# Altium project STM32-ROMI_Rev_A_Reworks.PrjPcb (part 2 of 3)

## Sheet STM32-ROMI_Rev_A_3_OLED_Sensor.SchDoc
size A
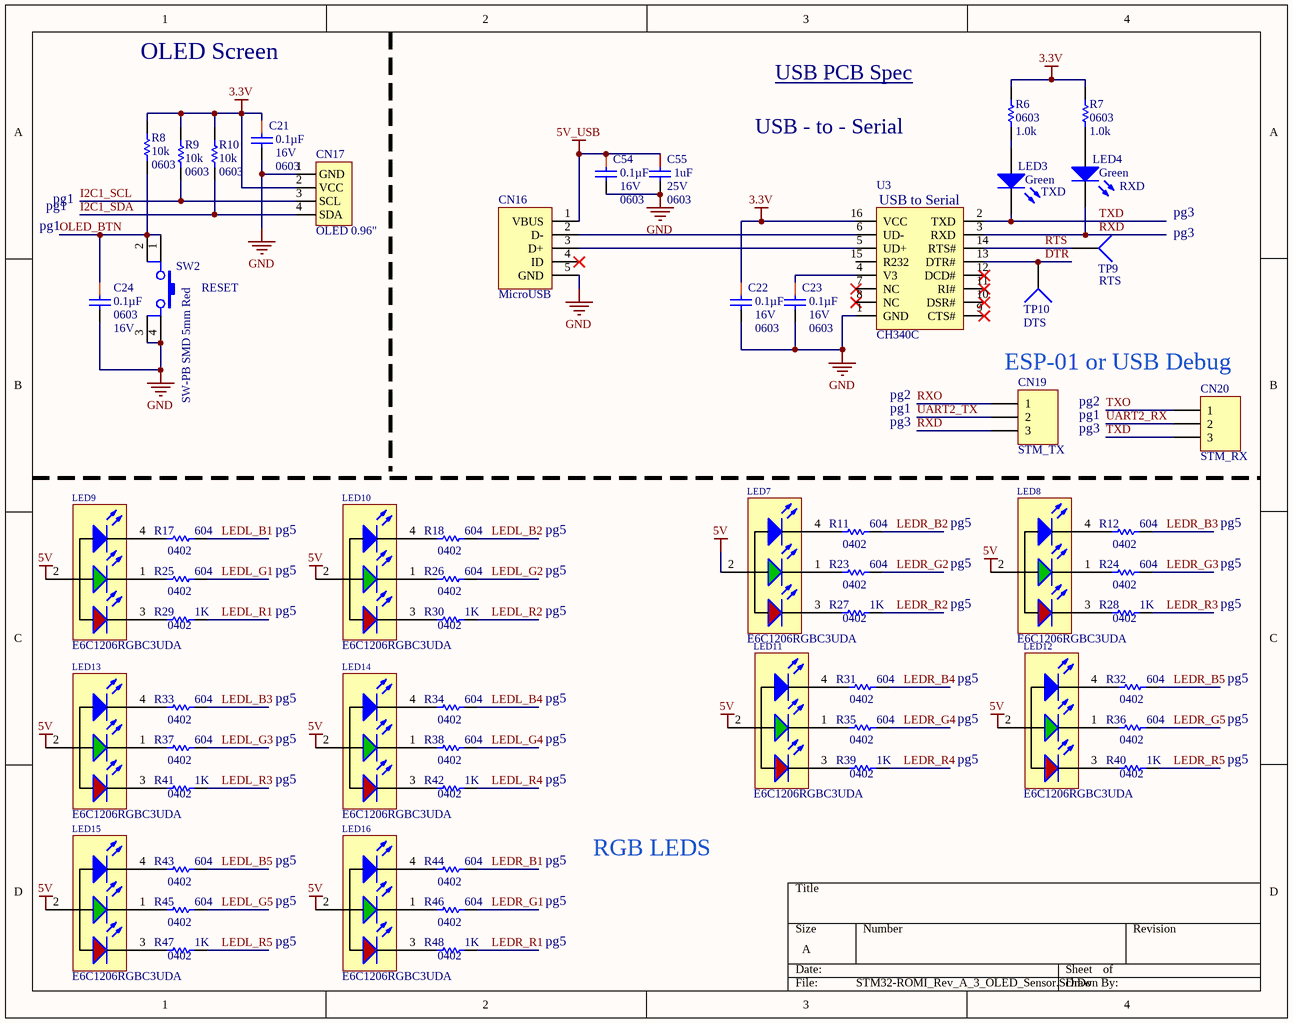
[diagram p3: STM32-ROMI_Rev_A_3_OLED_Sensor.SchDoc]

### Parts
C21  Capacitance: 0.1µF  Package / Case: 0603  Voltage - Rated: 16V  [CAPC0603(1608)_L]  (hidden comment: 0.1uF)
C22  Capacitance: 0.1µF  Package / Case: 0603  Voltage - Rated: 16V  [CAPC0603(1608)_L]  (hidden comment: 0.1uF)
C23  Capacitance: 0.1µF  Package / Case: 0603  Voltage - Rated: 16V  [CAPC0603(1608)_L]  (hidden comment: 0.1uF)
C24  Capacitance: 0.1µF  Package / Case: 0603  Voltage - Rated: 16V  [CAPC0603(1608)_L]  (hidden comment: 0.1uF)
C54  Capacitance: 0.1µF  Package / Case: 0603  Voltage - Rated: 16V  [CAPC0603(1608)_L]  (hidden comment: 0.1uF)
C55  1uF  Voltage - Rated: 25V  Package / Case: 0603  [CAPC0603(1608)_N]
CN16  MicroUSB  [10118194-0001LF]
CN17  OLED 0.96"  [OLED_0.96_I2C]
CN19  STM_TX  [HDR1X3]
CN20  STM_RX  [HDR1X3]
LED3  TXD  Color: Green  [SM-LED-0603]
LED4  RXD  Color: Green  [SM-LED-0603]
LED7  E6C1206RGBC3UDA  [E6C1206RGBC3UDA]
LED8  E6C1206RGBC3UDA  [E6C1206RGBC3UDA]
LED9  E6C1206RGBC3UDA  [E6C1206RGBC3UDA]
LED10  E6C1206RGBC3UDA  [E6C1206RGBC3UDA]
LED11  E6C1206RGBC3UDA  [E6C1206RGBC3UDA]
LED12  E6C1206RGBC3UDA  [E6C1206RGBC3UDA]
LED13  E6C1206RGBC3UDA  [E6C1206RGBC3UDA]
LED14  E6C1206RGBC3UDA  [E6C1206RGBC3UDA]
LED15  E6C1206RGBC3UDA  [E6C1206RGBC3UDA]
LED16  E6C1206RGBC3UDA  [E6C1206RGBC3UDA]
R6  Package / Case: 0603  [RESC0603(1608)_N]  (hidden comment: 1.0K)
R7  Package / Case: 0603  [RESC0603(1608)_N]  (hidden comment: 1.0K)
R8  Resistance (Ohms): 10k  Package / Case: 0603  [RESC0603(1608)_L]  (hidden comment: 10K 1%)
R9  Resistance (Ohms): 10k  Package / Case: 0603  [RESC0603(1608)_L]  (hidden comment: 10K 1%)
R10  Resistance (Ohms): 10k  Package / Case: 0603  [RESC0603(1608)_L]  (hidden comment: 10K 1%)
R11  604  Supplier Device Package: 0402  [RESC0402(1005)_L]
R12  604  Supplier Device Package: 0402  [RESC0402(1005)_L]
R17  604  Supplier Device Package: 0402  [RESC0402(1005)_L]
R18  604  Supplier Device Package: 0402  [RESC0402(1005)_L]
R23  604  Supplier Device Package: 0402  [RESC0402(1005)_L]
R24  604  Supplier Device Package: 0402  [RESC0402(1005)_L]
R25  604  Supplier Device Package: 0402  [RESC0402(1005)_L]
R26  604  Supplier Device Package: 0402  [RESC0402(1005)_L]
R27  Case Code (Imperial): 0402  [RESC0402(1005)_L]  (hidden comment: 1K)
R28  Case Code (Imperial): 0402  [RESC0402(1005)_L]  (hidden comment: 1K)
R29  Case Code (Imperial): 0402  [RESC0402(1005)_L]  (hidden comment: 1K)
R30  Case Code (Imperial): 0402  [RESC0402(1005)_L]  (hidden comment: 1K)
R31  604  Supplier Device Package: 0402  [RESC0402(1005)_L]
R32  604  Supplier Device Package: 0402  [RESC0402(1005)_L]
R33  604  Supplier Device Package: 0402  [RESC0402(1005)_L]
R34  604  Supplier Device Package: 0402  [RESC0402(1005)_L]
R35  604  Supplier Device Package: 0402  [RESC0402(1005)_L]
R36  604  Supplier Device Package: 0402  [RESC0402(1005)_L]
R37  604  Supplier Device Package: 0402  [RESC0402(1005)_L]
R38  604  Supplier Device Package: 0402  [RESC0402(1005)_L]
R39  Case Code (Imperial): 0402  [RESC0402(1005)_L]  (hidden comment: 1K)
R40  Case Code (Imperial): 0402  [RESC0402(1005)_L]  (hidden comment: 1K)
R41  Case Code (Imperial): 0402  [RESC0402(1005)_L]  (hidden comment: 1K)
R42  Case Code (Imperial): 0402  [RESC0402(1005)_L]  (hidden comment: 1K)
R43  604  Supplier Device Package: 0402  [RESC0402(1005)_L]
R44  604  Supplier Device Package: 0402  [RESC0402(1005)_L]
R45  604  Supplier Device Package: 0402  [RESC0402(1005)_L]
R46  604  Supplier Device Package: 0402  [RESC0402(1005)_L]
R47  Case Code (Imperial): 0402  [RESC0402(1005)_L]  (hidden comment: 1K)
R48  Case Code (Imperial): 0402  [RESC0402(1005)_L]  (hidden comment: 1K)
SW2  RESET  [SW TACT Red 6mm x 6mm]
TP9  RTS  [TestPoint-SM]  (no BOM)
TP10  DTS  [TestPoint-SM]  (no BOM)
U3  CH340C  [SOP-16]

### Nets
3.3V: C21.1 C22.1 CN17.2(VCC) R6.2 R7.2 R8.2 R9.2 R10.2 U3.16(VCC)
5V: LED7.2(+) LED8.2(+) LED9.2(+) LED10.2(+) LED11.2(+) LED12.2(+) LED13.2(+) LED14.2(+) LED15.2(+) LED16.2(+)
5V_USB: C54.1 C55.1 CN16.1(VBUS)
GND: C21.2 C22.2 C23.2 C24.2 C54.2 C55.2 CN16.5(GND) CN17.1(GND) SW2.3 SW2.4 U3.1(GND)
DTR: TP10.1 U3.13(DTR#)
I2C1_SCL: CN17.3(SCL) R9.1
I2C1_SDA: CN17.4(SDA) R10.1
LEDL_B1: R17.1
LEDL_B2: R18.1
LEDL_B3: R33.1
LEDL_B4: R34.1
LEDL_B5: R43.1
LEDL_G1: R25.1
LEDL_G2: R26.1
LEDL_G3: R37.1
LEDL_G4: R38.1
LEDL_G5: R45.1
LEDL_R1: R29.1
LEDL_R2: R30.1
LEDL_R3: R41.1
LEDL_R4: R42.1
LEDL_R5: R47.1
LEDR_B1: R44.1
LEDR_B2: R11.1
LEDR_B3: R12.1
LEDR_B4: R31.1
LEDR_B5: R32.1
LEDR_G1: R46.1
LEDR_G2: R23.1
LEDR_G3: R24.1
LEDR_G4: R35.1
LEDR_G5: R36.1
LEDR_R1: R48.1
LEDR_R2: R27.1
LEDR_R3: R28.1
LEDR_R4: R39.1
LEDR_R5: R40.1
OLED_BTN: C24.1 R8.1 SW2.1 SW2.2
RTS: TP9.1 U3.14(RTS#)
RXD: CN19.3 LED4.2 U3.3(RXD)
RXO: CN19.1
TXD: CN20.3 LED3.2 U3.2(TXD)
TXO: CN20.1
UART2_RX: CN20.2
UART2_TX: CN19.2
NetC23_1: C23.1 U3.4(V3)
NetCN16_2: CN16.2(D-) U3.6(UD-)
NetCN16_3: CN16.3(D+) U3.5(UD+)
NetLED3_1: LED3.1 R6.1
NetLED4_1: LED4.1 R7.1
NetLED7_1: LED7.1(B) R23.2
NetLED7_3: LED7.3(A) R27.2
NetLED7_4: LED7.4(R) R11.2
NetLED8_1: LED8.1(B) R24.2
NetLED8_3: LED8.3(A) R28.2
NetLED8_4: LED8.4(R) R12.2
NetLED9_1: LED9.1(B) R25.2
NetLED9_3: LED9.3(A) R29.2
NetLED9_4: LED9.4(R) R17.2
NetLED10_1: LED10.1(B) R26.2
NetLED10_3: LED10.3(A) R30.2
NetLED10_4: LED10.4(R) R18.2
NetLED11_1: LED11.1(B) R35.2
NetLED11_3: LED11.3(A) R39.2
NetLED11_4: LED11.4(R) R31.2
NetLED12_1: LED12.1(B) R36.2
NetLED12_3: LED12.3(A) R40.2
NetLED12_4: LED12.4(R) R32.2
NetLED13_1: LED13.1(B) R37.2
NetLED13_3: LED13.3(A) R41.2
NetLED13_4: LED13.4(R) R33.2
NetLED14_1: LED14.1(B) R38.2
NetLED14_3: LED14.3(A) R42.2
NetLED14_4: LED14.4(R) R34.2
NetLED15_1: LED15.1(B) R45.2
NetLED15_3: LED15.3(A) R47.2
NetLED15_4: LED15.4(R) R43.2
NetLED16_1: LED16.1(B) R46.2
NetLED16_3: LED16.3(A) R48.2
NetLED16_4: LED16.4(R) R44.2

Not connected (* = marked no-connect by the designer): CN16 4(ID)*; U3 7(NC)* 8(NC)* 9(CTS#)* 10(DSR#)* 11(RI#)* 12(DCD#)* 15(R232)

### Notes on the sheet
- OLED Screen
- USB PCB Spec <https://www.ftdichip.com/Support/Documents/AppNotes/AN_146_USB_Hardware_Design_Guidelines_for_FTDI_ICs.pdf>
- USB - to - Serial
- pg1
- pg3
- ESP-01 or USB Debug
- pg2
- (near LED10) pg5
- pg5
- (near LED8) pg5
- (near LED14) pg5
- (near LED12) pg5
- (near LED16) pg5
- RGB LEDS
- (in symbol CH340C) USB to Serial

### Library data of the parts
C21-C24 C54 = CAP CER 0.1UF 16V 10% X7R 0603: 0.1uF 0603 16V; Manufacturer: Kemet; Manufacturer Part Number: C0603C104K4RACTU; Tolerance: ±10%; Temperature Coefficient: X7R; Supplier 1: Digi-Key; RoHS: RoHS Compliant; Category: Capacitors; Stock 1: 2360000; Pricing 1: 4000=0.00414, 8000=0.00378, 12000=0.0036, 28000=0.00342, 100000=0.00248 (USD); Packaging: Tape & Reel (TR); Mounting Type: Surface Mount, MLCC; Operating Temperature: -55°C ~ 125°C; Applications: General Purpose; Ratings: -; Size / Dimension: 0.063" L x 0.031" W (1.60mm x 0.80mm); Height - Seated (Max): -; Thickness (Max): 0.034" (0.87mm); Lead Spacing: -; Features: -; Lead Style: -; ComponentLink1URL: http://www.kemet.com/datasheets&C0603C104K4RACTU; ComponentLink1Description: http://www.kemet.com/datasheets&C0603C104K4RACTU; Supplier Part Number 1: 399-1096-2-ND
C55 = CAP CER 1UF 25V 10% X7R 0603: 1uF 0603 25V; Manufacturer: TDK Corporation; Manufacturer Part Number: CGA3E1X7R1E105K080AC; Tolerance: ±10%; Temperature Coefficient: X7R; Supplier 1: Digi-Key; RoHS: RoHS Compliant; Category: Capacitors; Stock 1: 360610; Pricing 1: 1=0.2, 10=0.135, 100=0.0686, 500=0.04696, 1000=0.04154 (USD); Packaging: Cut Tape (CT); Part Status: Active; Operating Temperature: -55°C ~ 125°C; Features: -; Ratings: AEC-Q200; Applications: Automotive; Failure Rate: -; Mounting Type: Surface Mount, MLCC; Size / Dimension: 0.063" L x 0.032" W (1.60mm x 0.80mm); Height - Seated (Max): -; Thickness (Max): 0.035" (0.90mm); Lead Spacing: -; Lead Style: -; ComponentLink1URL: https://product.tdk.com/info/en/catalog/datasheets/mlcc_automotive_general_en.pdf; ComponentLink1Description: https://product.tdk.com/info/en/catalog/datasheets/mlcc_automotive_general_en.pdf; Supplier Part Number 1: 445-6931-1-ND
CN16 = 10118194-0001LF: Amphenol FCI CONN USB MICRO B RECPT SMT R/A; Connector Type: USB - micro B; Number of Contacts: 5; Gender: Receptacle; Specifications: USB 2.0; Number of Ports: 1; Current Rating: 1.8A per Contact; Voltage - Rated: 100VAC; Mating Cycles: 10000; Shielding: Shielded; Material Flammability Rating: UL94 V-0; ClassName: *; Supplier 1: Digi-Key; Manufacturer: Amphenol FCI; Manufacturer Part Number: 10118194-0001LF; RoHS: RoHS Compliant; Category: Connectors, Interconnects; Stock 1: 220681; Pricing 1: 1=0.46, 10=0.437, 25=0.3744, 50=0.318, 100=0.3056, 250=0.27444, 500=0.26196 (USD); Packaging: Cut Tape (CT); Part Status: Active; Mounting Type: Surface Mount, Right Angle; Through Hole; Mounting Feature: Horizontal; Termination: Solder; Features: Solder Retention; Ingress Protection: -; Operating Temperature: -30°C ~ 80°C; Contact Finish: Gold; Shell/Shielding Material: Steel, Stainless; Insulation Color: Black; ComponentLink1URL: http://portal.fciconnect.com/Comergent//fci/drawing/10118194.pdf; ComponentLink1Description: http://portal.fciconnect.com/Comergent//fci/drawing/10118194.pdf; Supplier Part Number 1: 609-4618-1-ND
CN17 = OLED_0.96_I2C: SSD1306 I2C OLED 0.96"
CN19 CN20 = Header 3: Header, 3-Pin; Manufacturer: Sullins Connector Solutions; Manufacturer Part Number: PRPC003SAAN-RC; Connector Type: Header, Unshrouded, Breakaway; Number of Positions: 3; Number of Positions Loaded: All; Pitch: 0.100" (2.54mm); Supplier 1: Digi-Key; RoHS: RoHS Compliant; Category: Connectors, Interconnects; Stock 1: 0; Pricing 1: 1=0.18, 10=0.16, 100=0.132, 500=0.10438, 1000=0.0896, 5000=0.08174, 10000=0.0786 (USD); Packaging: Bulk; Contact Type: Male Pin; Number of Rows: 1; Row Spacing: -; Contact Mating Length: 0.230" (5.84mm); Mounting Type: Through Hole; Termination: Solder; Fastening Type: -; Features: -; Contact Finish: Gold; Contact Finish Thickness: Flash; Color: Black; ComponentLink1URL: http://media.digikey.com/PDF/Data%20Sheets/Sullins%20PDFs/xRxCzzzSxxN-RC_ST_11635-B.pdf; ComponentLink1Description: http://media.digikey.com/PDF/Data%20Sheets/Sullins%20PDFs/xRxCzzzSxxN-RC_ST_11635-B.pdf; Supplier Part Number 1: S1011EC-03-ND
LED3 LED4 = LTST-C191KGKT: LED GREEN CLEAR THIN 0603 SMD; Manufacturer: Lite-On Inc; Wavelength - Dominant: 571nm; Wavelength - Peak: 574nm; Millicandela Rating: 35mcd; Voltage - Forward (Vf) (Typ): 2V; Current - Test: 20mA; Viewing Angle: 130°; Lens Style/Size: Rectangle with Flat Top, 1.1mm x 0.8mm; Supplier 1: Digi-Key; Manufacturer Part Number: LTST-C191KGKT; RoHS: RoHS Compliant; Category: Optoelectronics; Stock 1: 84829; Pricing 1: 1=0.3, 10=0.238, 100=0.1296, 250=0.0864, 500=0.07344, 1000=0.05616, 2500=0.05076 (USD); Packaging: Cut Tape (CT); Lens Type: Clear; Package / Case: 0603 (1608 Metric); Size / Dimension: 1.60mm L x 0.80mm W; Height: 0.55mm; Mounting Type: Surface Mount; Luminous Flux @ Current - Test: -; ComponentLink1URL: http://optoelectronics.liteon.com/upload/download/DS22-2000-228/S_110_LTST-C191KGKT.pdf; ComponentLink1Description: http://optoelectronics.liteon.com/upload/download/DS22-2000-228/S_110_LTST-C191KGKT.pdf; Supplier Part Number 1: 160-1446-1-ND; ClassName: *
LED7-LED16 = RGB LED: RGB 620NMRED, 520NMGREEN, 465NMBLUE SMD,; ComponentLink1Description: Datasheet; ComponentLink1URL: https://datasheet.lcsc.com/szlcsc/1912111437_EKINGLUX-E6C1206RGBC3UDA_C375571.pdf; Supplier 1: LCSC; Supplier Part Number 1: C375571
R6 R7 = RES 1K OHM 1% 1/10W 0603: 1.0K 0603; Manufacturer: Stackpole Electronics Inc.; Manufacturer Part Number: RMCF0603FT1K00; Tolerance: ±1%; Power (Watts): 0.1W, 1/10W; Temperature Coefficient: ±100ppm/°C; Supplier 1: Digi-Key; RoHS: RoHS Compliant; Category: Resistors; Stock 1: 411308; Pricing 1: 1=0.1, 10=0.02, 100=0.0081, 1000=0.00364, 2500=0.00316 (USD); Packaging: Cut Tape (CT); Part Status: Active; Composition: Thick Film; Features: Automotive AEC-Q200; Operating Temperature: -55°C ~ 155°C; Size / Dimension: 0.061" L x 0.031" W (1.55mm x 0.80mm); Height - Seated (Max): 0.022" (0.55mm); Failure Rate: -; ComponentLink1URL: https://www.seielect.com/Catalog/SEI-RMCF_RMCP.pdf; ComponentLink1Description: https://www.seielect.com/Catalog/SEI-RMCF_RMCP.pdf; Supplier Part Number 1: RMCF0603FT1K00CT-ND; Supplier Device Package: 0603; Resistance (Ohms): 1.0k
R8-R10 = RES 10K OHM 1/10W 1% 0603 SMD: 10K 0603; Manufacturer: Panasonic Electronic Components; Manufacturer Part Number: ERJ-3EKF1002V; Power (Watts): 0.1W, 1/10W; Temperature Coefficient: ±100ppm/°C; Category: Resistors; Supplier 1: Digi-Key; RoHS: RoHS Compliant; Stock 1: 5046430; Pricing 1: 1=0.1, 50=0.015, 100=0.0114, 250=0.00844, 500=0.00624, 1000=0.00416, 2500=0.00351 (USD); Packaging: Cut Tape (CT); Tolerance: ±1%; Composition: Thick Film; Features: -; Supplier Device Package: 0603; Size / Dimension: 0.063" L x 0.031" W (1.60mm x 0.80mm); Height: 0.022" (0.55mm); Number of Terminations: 2; ComponentLink1URL: http://industrial.panasonic.com/www-cgi/jvcr13pz.cgi?E+PZ+3+AOA0002+ERJ3EKF1002V+7+WW; ComponentLink1Description: http://industrial.panasonic.com/www-cgi/jvcr13pz.cgi?E+PZ+3+AOA0002+ERJ3EKF1002V+7+WW; Supplier Part Number 1: P10.0KHCT-ND
R11 R12 R17 R18 R23-R26 R31-R38 R43-R46 = RES 604 OHM 1% 1/10W 0402: 604 0402; Manufacturer: Panasonic Electronic Components; Manufacturer Part Number: ERA-2AEB6040X; Tolerance: ±0.1%; Power (Watts): 0.063W, 1/16W; Temperature Coefficient: ±25ppm/°C; Supplier 1: Digi-Key; RoHS: RoHS Compliant; Category: Resistors; Stock 1: 12841; Pricing 1: 1=0.45, 10=0.321, 100=0.1283, 1000=0.06322, 2500=0.05858, 5000=0.053 (USD); Packaging: Cut Tape (CT); Part Status: Active; Composition: Thin Film; Features: Automotive AEC-Q200; Operating Temperature: -55°C ~ 155°C; Package / Case: 0402 (1005 Metric); Size / Dimension: 0.039" L x 0.020" W (1.00mm x 0.50mm); Height - Seated (Max): 0.016" (0.40mm); Failure Rate: -; ComponentLink1URL: https://industrial.panasonic.com/cdbs/www-data/pdf/RDM0000/AOA0000C307.pdf; ComponentLink1Description: https://industrial.panasonic.com/cdbs/www-data/pdf/RDM0000/AOA0000C307.pdf; Supplier Part Number 1: P604DCCT-ND
R27-R30 R39-R42 R47 R48 = RES 1K OHM 1% 1/16W 0402: 1K 0402; Manufacturer: Yageo; Manufacturer Part Number: RC0402FR-071KL; Tolerance: 1%; Temperature Coefficient: 100ppm/°C; Power Rating: 62.5mW; Voltage Rating: 50V; ComponentLink1URL: https://datasheet.ciiva.com/2453/pyu-r-int-thick-7-2453361.pdf; ComponentLink1Description: https://datasheet.ciiva.com/2453/pyu-r-int-thick-7-2453361.pdf; ComponentLink2URL: https://datasheet.ciiva.com/2453/pyu-r-int-thick-7-2453362.pdf; ComponentLink2Description: https://datasheet.ciiva.com/2453/pyu-r-int-thick-7-2453362.pdf; ComponentLink3URL: https://datasheet.ciiva.com/2453/pyu-r-int-thick-7-2453363.pdf; ComponentLink3Description: https://datasheet.ciiva.com/2453/pyu-r-int-thick-7-2453363.pdf; ComponentLink4URL: https://datasheet.ciiva.com/22747/1018594-22747509.pdf; ComponentLink4Description: https://datasheet.ciiva.com/22747/1018594-22747509.pdf; ComponentLink5URL: https://datasheet.ciiva.com/15189/getdatasheetpartid-323696-15189334.pdf; ComponentLink5Description: https://datasheet.ciiva.com/15189/getdatasheetpartid-323696-15189334.pdf; ComponentLink6URL: https://datasheet.ciiva.com/16740/pyu-rc0402-51-rohs-l-6-r-16740567.pdf; ComponentLink6Description: https://datasheet.ciiva.com/16740/pyu-rc0402-51-rohs-l-6-r-16740567.pdf; ComponentLink7URL: https://datasheet.ciiva.com/12667/pyu-rc0402-51-rohs-l-6-r-12667930.pdf; ComponentLink7Description: https://datasheet.ciiva.com/12667/pyu-rc0402-51-rohs-l-6-r-12667930.pdf; ComponentLink8URL: https://datasheet.ciiva.com/11819/0900766b80c66297-11819452.pdf; ComponentLink8Description: https://datasheet.ciiva.com/11819/0900766b80c66297-11819452.pdf; Supplier 1: Digi-Key; Supplier Part Number 1: 311-1.00KLRCT-ND; Stock 1: 21888659; Pricing 1: 1=0.1, 10=0.014, 100=0.0056, 1000=0.0025, 2500=0.0022, 5000=0.0018 (USD); Case/Package: 0402; Number of Pins: 2; Case Code (Metric): 1005; Min Operating Temperature: -55°C; Max Operating Temperature: 155°C; Packaging: Tape and Reel; Composition: Thick Film; Voltage Rating (DC): 50V; Termination: SMD/SMT; Military Standard: Not; Length: 1mm; Height: 0.32mm; Width: 0.5mm; Depth: 0.5mm; REACH SVHC: Unknown; Lead Free: Lead Free; ComponentLink9URL: https://datasheet.ciiva.com/11819/0900766b80c66297-11819477.pdf; ComponentLink9Description: https://datasheet.ciiva.com/11819/0900766b80c66297-11819477.pdf; ComponentLink10URL: https://datasheet.ciiva.com/12666/pyu-rc0402-51-rohs-l-6-r-12666741.pdf; ComponentLink10Description: https://datasheet.ciiva.com/12666/pyu-rc0402-51-rohs-l-6-r-12666741.pdf; ComponentLink11URL: https://datasheet.ciiva.com/17063/pyu-rc0402-51-rohs-l-6-r-17063193.pdf; ComponentLink11Description: https://datasheet.ciiva.com/17063/pyu-rc0402-51-rohs-l-6-r-17063193.pdf; ComponentLink12URL: https://datasheet.ciiva.com/22747/1018594-22747513.pdf; ComponentLink12Description: https://datasheet.ciiva.com/22747/1018594-22747513.pdf; ComponentLink13URL: https://datasheet.ciiva.com/7849/1018594-7849869.pdf; ComponentLink13Description: https://datasheet.ciiva.com/7849/1018594-7849869.pdf; ComponentLink14URL: https://datasheet.ciiva.com/7983/1018594-7983502.pdf; ComponentLink14Description: https://datasheet.ciiva.com/7983/1018594-7983502.pdf; ComponentLink15URL: https://datasheet.ciiva.com/7849/1018594-7849871.pdf; ComponentLink15Description: https://datasheet.ciiva.com/7849/1018594-7849871.pdf; Category: Resistors; Resistance: 1K; Package / Case: 0402
SW2 = SW-PB SMD 5mm Red: SWITCH TACTILE SPST-NO 0.05A 12V; Manufacturer: C&K Components; Manufacturer Part Number: PTS645SK50SMTR92 LFS; Switch Function: Off-Mom; Contact Rating @ Voltage: 0.05A @ 12VDC; Actuator Type: Standard; Actuator Height off PCB, from Pins: 5.00mm; Actuator Orientation: Top Actuated; Outline: 6.00mm x 6.00mm; Illumination: Non-Illuminated; Operating Force: 260gf; Actuator Material: Polyamide (PA66), Nylon 6/6; Mechanical Life: 100,000 Cycles; Published: 24-Mar-1999; LatestRevisionDate: 17-Jul-2002; LatestRevisionNote: Re-released for DXP Platform.; PackageReference: SPST-2; Publisher: Altium Limited; PackageDescription: Switch; 2 Leads; Supplier 1: Digi-Key; RoHS: RoHS Compliant; Category: Switches; Stock 1: 24906; Pricing 1: 1=0.28, 10=0.271, 25=0.262, 50=0.2524, 100=0.2384, 250=0.2244, 500=0.21506 (USD); Packaging: Cut Tape (CT); Circuit: SPST-NO; Mounting Type: Surface Mount; Termination Style: Gull Wing; Illumination Voltage (Nominal): -; Illumination Type, Color: -; Ingress Protection: -; Features: -; Switch Travel: -; Operating Temperature: -20°C ~ 60°C; ComponentLink1URL: http://www.ck-components.com/14409/pts645_25apr13.pdf/; ComponentLink1Description: http://www.ck-components.com/14409/pts645_25apr13.pdf/; Supplier Part Number 1: CKN9087CT-ND; ClassName: USwitch; Text: SW-PB SMD 5mm Red
TP9 TP10 = TestPoint: Test Point
U3 = CH340C: USB to Serial UART; ComponentLink2URL: https://lcsc.com/product-detail/USB_CH340C_C84681.html; ComponentLink1URL: https://www.sparkfun.com/products/15096; ComponentLink2Description: LCSC Part Link; ComponentLink1Description: Sparkfun Demo Board

## Sheet STM32-ROMI_Rev_A_4_3V_5V.SchDoc: Power
size A; DocumentNumber: 7122020; Revision: A; SheetNumber: 4; SheetTotal: 7
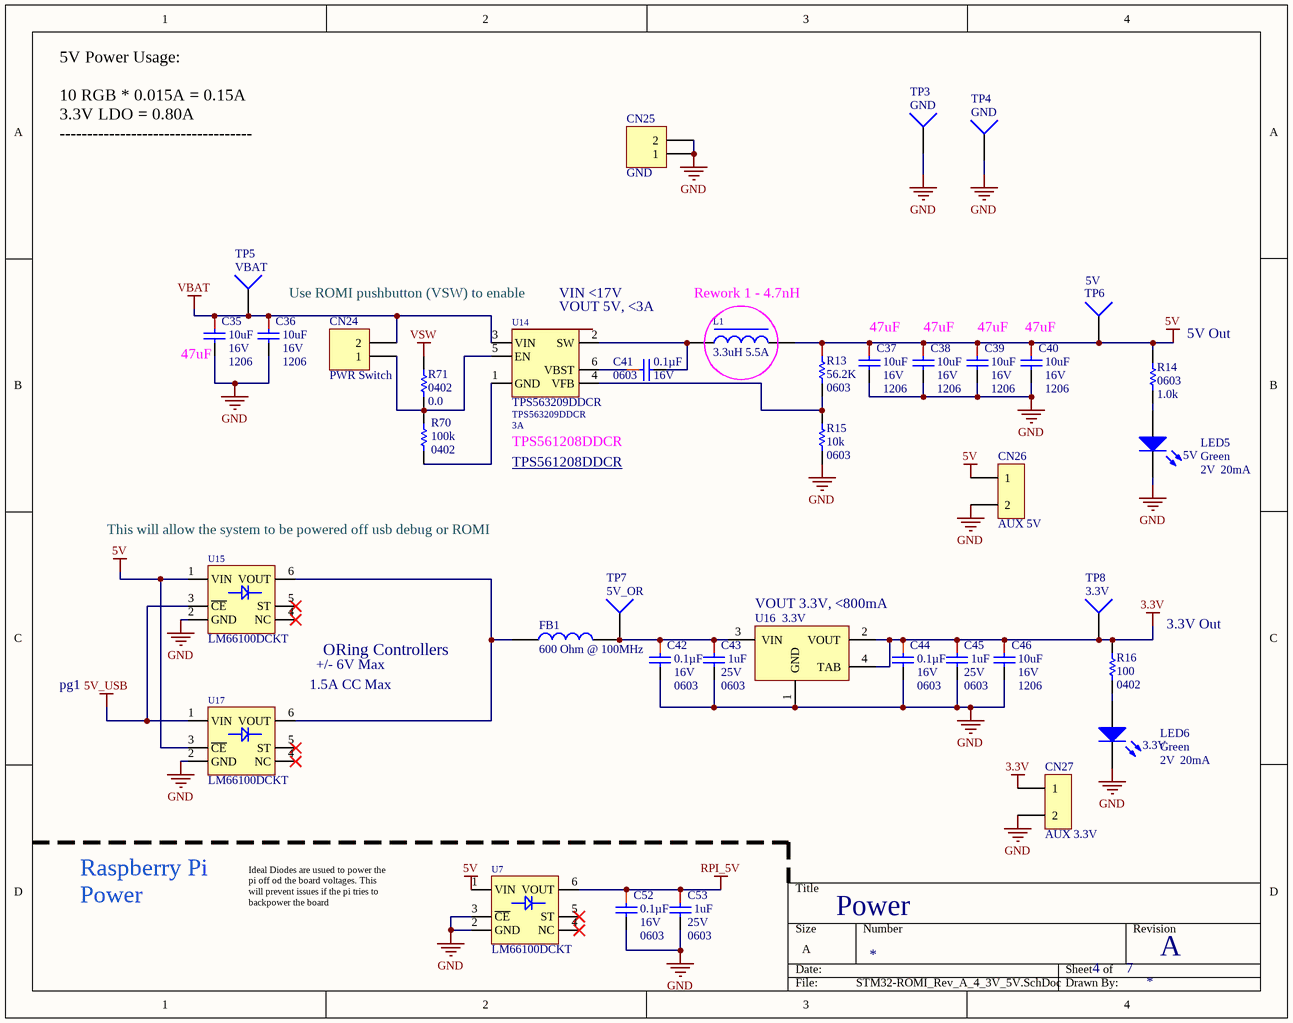
[diagram p4: STM32-ROMI_Rev_A_4_3V_5V.SchDoc]

### Parts
C35  10uF  Voltage - Rated: 16V  Package: 1206  [CAPC1206(3216)_M]
C36  10uF  Voltage - Rated: 16V  Package: 1206  [CAPC1206(3216)_M]
C37  10uF  Voltage - Rated: 16V  Package: 1206  [CAPC1206(3216)_M]
C38  10uF  Voltage - Rated: 16V  Package: 1206  [CAPC1206(3216)_M]
C39  10uF  Voltage - Rated: 16V  Package: 1206  [CAPC1206(3216)_M]
C40  10uF  Voltage - Rated: 16V  Package: 1206  [CAPC1206(3216)_M]
C41  Capacitance: 0.1µF  Package / Case: 0603  Voltage - Rated: 16V  [CAPC0603(1608)_L]  (hidden comment: 0.1uF)
C42  Capacitance: 0.1µF  Package / Case: 0603  Voltage - Rated: 16V  [CAPC0603(1608)_L]  (hidden comment: 0.1uF)
C43  1uF  Voltage - Rated: 25V  Package / Case: 0603  [CAPC0603(1608)_N]
C44  Capacitance: 0.1µF  Package / Case: 0603  Voltage - Rated: 16V  [CAPC0603(1608)_L]  (hidden comment: 0.1uF)
C45  1uF  Voltage - Rated: 25V  Package / Case: 0603  [CAPC0603(1608)_N]
C46  10uF  Voltage - Rated: 16V  Package: 1206  [CAPC1206(3216)_M]
C52  Capacitance: 0.1µF  Package / Case: 0603  Voltage - Rated: 16V  [CAPC0603(1608)_L]  (hidden comment: 0.1uF)
C53  1uF  Voltage - Rated: 25V  Package / Case: 0603  [CAPC0603(1608)_N]
CN24  PWR Switch  [HDR1X2]
CN25  GND  [HDR1X2]
CN26  AUX 5V  [Molex 1x2 Microfit 3.0]
CN27  AUX 3.3V  [Molex 1x2 Microfit 3.0]
FB1  600 Ohm @ 100MHz  [RESC0805(2012)_N]
L1  3.3uH 5.5A  [YSPI0530-3R3M]
LED5  5V  Color: Green  Voltage - Forward (Vf) (Typ): 2V  Current - Test: 20mA  [SM-LED-0603]
LED6  3.3V  Color: Green  Voltage - Forward (Vf) (Typ): 2V  Current - Test: 20mA  [SM-LED-0603]
R13  56.2K  Package / Case: 0603  [RESC0603(1608)_L]
R14  Package / Case: 0603  [RESC0603(1608)_N]  (hidden comment: 1.0K)
R15  Resistance (Ohms): 10k  Package / Case: 0603  [RESC0603(1608)_L]  (hidden comment: 10K 1%)
R16  100  Supplier Device Package: 0402  [RESC0402(1005)_N]
R70  Supplier Device Package: 0402  Resistance (Ohms): 100k  [RESC0402(1005)_L]  (hidden comment: 100K 0402)
R71  Supplier Device Package: 0402  Resistance (Ohms): 0.0  [RESC0402(1005)_L]  (hidden comment: 0)
TP3  GND  [TestPoint-SM]  (no BOM)
TP4  GND  [TestPoint-SM]  (no BOM)
TP5  VBAT  [TestPoint-SM]  (no BOM)
TP6  5V  [TestPoint-SM]  (no BOM)
TP7  5V_OR  [TestPoint-SM]  (no BOM)
TP8  3.3V  [TestPoint-SM]  (no BOM)
U7  LM66100DCKT  [SC-70-6]
U14  TPS563209DDCR  Current - Output: 3A  [SOT23-6]
U15  LM66100DCKT  [SC-70-6]
U16  3.3V  [DSO-G3]
U17  LM66100DCKT  [SC-70-6]

### Nets
3.3V: C44.1 C45.1 C46.1 CN27.1 R16.2 TP8.1 U16.2(VOUT) U16.4(TAB)
5V: C37.1 C38.1 C39.1 C40.1 CN26.1 L1.2 R13.1 R14.2 TP6.1 U7.1(VIN) U15.1(VIN) U17.3(~{CE})
5V_USB: U15.3(~{CE}) U17.1(VIN)
GND: C35.2 C36.2 C37.2 C38.2 C39.2 C40.2 C42.2 C43.2 C44.2 C45.2 C46.2 C52.2 C53.2 CN25.1 CN25.2 CN26.2 CN27.2 LED5.2 LED6.2 R15.1 TP3.1 TP4.1 U7.2(GND) U7.3(~{CE}) U15.2(GND) U16.1(GND) U17.2(GND)
RPI_5V: C52.1 C53.1 U7.6(VOUT)
VBAT: C35.1 C36.1 CN24.2 TP5.1 U14.3(VIN)
VSW: R71.1
NetC41_1: C41.1 U14.6(VBST)
NetC41_2: C41.2 L1.1 U14.2(SW)
NetC42_1: C42.1 C43.1 FB1.2 TP7.1 U16.3(VIN)
NetCN24_1: CN24.1 R70.2 R71.2 U14.5(EN)
NetFB1_1: FB1.1 U15.6(VOUT) U17.6(VOUT)
NetLED5_1: LED5.1 R14.1
NetLED6_1: LED6.1 R16.1
NetR13_2: R13.2 R15.2 U14.4(VFB)
NetR70_1: R70.1 U14.1(GND)

Not connected (* = marked no-connect by the designer): U7 4(NC)* 5(ST)*; U15 4(NC)* 5(ST)*; U17 4(NC)* 5(ST)*

### Notes on the sheet
- 5V Power Usage:
  10 RGB * 0.015A = 0.15A
  3.3V LDO = 0.80A
  -----------------------------------
  = 0.95A
- Use ROMI pushbutton (VSW) to enable
- (near U14) VIN <17V
- Rework 1 - 4.7nH
- (near C35) 47uF
- (near U14) VOUT 5V, <3A
- 47uF
- (near C40) 47uF
- (near R14) 5V Out
- TPS561208DDCR
- TPS561208DDCR <https://webench.ti.com/appinfo/webench/scripts/SDP.cgi?ID=1CC5C5774496E8D5>
- (near U15) This will allow the system to be powered off usb debug or ROMI
- (near U16) VOUT 3.3V, <800mA
- 3.3V Out
- pg1
- 1.5A CC Max
- +/- 6V Max
- ORing Controllers
- Raspberry Pi
- Power
- Ideal Diodes are usued to power the pi off od the board voltages. This will prevent issues if the pi tries to backpower the board

### Library data of the parts
C35-C40 C46 = CAP CER 10UF 16V 1206: Temperature Coefficient: X7R; LCSC: C126600; Capacitance: 10uF; Supplier 1: Digi-Key; Supplier Part Number 1: 490-4793-1-ND
C41 C42 C44 C52 = CAP CER 0.1UF 16V 10% X7R 0603: as C21 on sheet STM32-ROMI_Rev_A_3_OLED_Sensor; Supplier 1: Digi-Key; RoHS: RoHS Compliant; Category: Capacitors; Stock 1: 2360000; Pricing 1: 4000=0.00414, 8000=0.00378, 12000=0.0036, 28000=0.00342, 100000=0.00248 (USD); Packaging: Tape & Reel (TR); Mounting Type: Surface Mount, MLCC; Operating Temperature: -55°C ~ 125°C; Applications: General Purpose; Ratings: -; Size / Dimension: 0.063" L x 0.031" W (1.60mm x 0.80mm); Height - Seated (Max): -; Thickness (Max): 0.034" (0.87mm); Lead Spacing: -; Features: -; Lead Style: -; ComponentLink1URL: http://www.kemet.com/datasheets&C0603C104K4RACTU; ComponentLink1Description: http://www.kemet.com/datasheets&C0603C104K4RACTU; Supplier Part Number 1: 399-1096-2-ND
C43 C45 C53 = CAP CER 1UF 25V 10% X7R 0603: as C55 on sheet STM32-ROMI_Rev_A_3_OLED_Sensor; Supplier 1: Digi-Key; RoHS: RoHS Compliant; Category: Capacitors; Stock 1: 360610; Pricing 1: 1=0.2, 10=0.135, 100=0.0686, 500=0.04696, 1000=0.04154 (USD); Packaging: Cut Tape (CT); Part Status: Active; Operating Temperature: -55°C ~ 125°C; Features: -; Ratings: AEC-Q200; Applications: Automotive; Failure Rate: -; Mounting Type: Surface Mount, MLCC; Size / Dimension: 0.063" L x 0.032" W (1.60mm x 0.80mm); Height - Seated (Max): -; Thickness (Max): 0.035" (0.90mm); Lead Spacing: -; Lead Style: -; ComponentLink1URL: https://product.tdk.com/info/en/catalog/datasheets/mlcc_automotive_general_en.pdf; ComponentLink1Description: https://product.tdk.com/info/en/catalog/datasheets/mlcc_automotive_general_en.pdf; Supplier Part Number 1: 445-6931-1-ND
CN24 CN25 = Header 2: Header, 2-Pin; Manufacturer: Sullins Connector Solutions; Manufacturer Part Number: PRPC002SAAN-RC; Connector Type: Header, Unshrouded, Breakaway; Number of Positions: 2; Number of Positions Loaded: All; Pitch: 0.100" (2.54mm); Supplier 1: Digi-Key; RoHS: RoHS Compliant; Category: Connectors, Interconnects; Stock 1: 4300; Pricing 1: 1=0.16, 10=0.145, 100=0.1198, 500=0.09466, 1000=0.08127, 5000=0.07414, 10000=0.07129 (USD); Packaging: Bulk; Contact Type: Male Pin; Number of Rows: 1; Row Spacing: -; Contact Mating Length: 0.230" (5.84mm); Mounting Type: Through Hole; Termination: Solder; Fastening Type: -; Features: -; Contact Finish: Gold; Contact Finish Thickness: Flash; Color: Black; ComponentLink1URL: http://media.digikey.com/PDF/Data%20Sheets/Sullins%20PDFs/xRxCzzzSxxN-RC_ST_11635-B.pdf; ComponentLink1Description: http://media.digikey.com/PDF/Data%20Sheets/Sullins%20PDFs/xRxCzzzSxxN-RC_ST_11635-B.pdf; Supplier Part Number 1: S1011EC-02-ND
CN26 CN27 = MICROFIT 3.0 HDR VERT CPI 2CKT: Molex Microfit 1x2 Vert Header; Manufacturer: Molex, LLC; Manufacturer Part Number: 0430450227; Shrouding: Shrouded - 4 Wall; Number of Positions: 2; Number of Positions Loaded: All; Row Spacing: 0.118" (3.00mm); Supplier 1: Digi-Key; RoHS: RoHS Compliant; Category: Connectors, Interconnects; Stock 1: 4002; Pricing 1: 1=0.8, 10=0.705, 50=0.636, 100=0.6083, 250=0.553, 500=0.4977, 1000=0.4424, 2500=0.40092, 5000=0.3871 (USD); Packaging: Tray; Part Status: Active; Connector Type: Header; Contact Type: Male Pin; Pitch: -; Number of Rows: 2; Mounting Type: Through Hole; Termination: Solder; Fastening Type: Locking Ramp; Contact Mating Length: -; Features: Board Guide; Contact Finish: Tin; Contact Finish Thickness: 60µin (1.52µm); Color: Black; ComponentLink1URL: http://www.molex.com/pdm_docs/sd/430450227_sd.pdf; ComponentLink1Description: http://www.molex.com/pdm_docs/sd/430450227_sd.pdf; Supplier Part Number 1: WM10657-ND
FB1 = FERRITE 600 OHM 2.0A 0805: 600 OHM 0805 2.0A; Manufacturer: Wurth Electronics Inc; Manufacturer Part Number: 742792040; Current Rating: 2A; DC Resistance (DCR): 150 mOhm Max; Filter Type: Differential Mode - Single; Supplier 1: Digi-Key; RoHS: RoHS Compliant; Category: Filters; Stock 1: 34670; Pricing 1: 1=0.24, 50=0.2344, 100=0.2156, 500=0.20624, 1000=0.19687, 2000=0.1875 (USD); Packaging: Cut Tape (CT); Package / Case: 0805 (2012 Metric); Mounting Type: Surface Mount; Height (Max): 0.043" (1.10mm); Size / Dimension: 0.079" L x 0.047" W (2.00mm x 1.20mm); ComponentLink1URL: http://katalog.we-online.de/pbs/datasheet/742792040.pdf; ComponentLink1Description: http://katalog.we-online.de/pbs/datasheet/742792040.pdf; Supplier Part Number 1: 732-1620-1-ND; ClassName: *; Creator: osman; Impedance @ Frequency: 600 Ohm @ 100MHz
L1 = FIXED IND 3.3UH 5.5A 28 MOHM SMD: Power Inductors 3.3uH ±20% 5.5A SMD,5.2x4.7x3mm RoHS; LCSC: C351097; Manufacturer Part: YSPI0530-3R3M; ComponentLink1Description: https://datasheet.lcsc.com/szlcsc/1812181731_YJYCOIN-YSPI0530-3R3M_C351097.pdf; ComponentLink1URL: https://datasheet.lcsc.com/szlcsc/1812181731_YJYCOIN-YSPI0530-3R3M_C351097.pdf
LED5 LED6 = LTST-C191KGKT: LED GREEN CLEAR THIN 0603 SMD; Manufacturer: Lite-On Inc; Wavelength - Dominant: 571nm; Wavelength - Peak: 574nm; Millicandela Rating: 35mcd; Viewing Angle: 130°; Lens Style/Size: Rectangle with Flat Top, 1.1mm x 0.8mm; Supplier 1: Digi-Key; Manufacturer Part Number: LTST-C191KGKT; RoHS: RoHS Compliant; Category: Optoelectronics; Stock 1: 84829; Pricing 1: 1=0.3, 10=0.238, 100=0.1296, 250=0.0864, 500=0.07344, 1000=0.05616, 2500=0.05076 (USD); Packaging: Cut Tape (CT); Lens Type: Clear; Package / Case: 0603 (1608 Metric); Size / Dimension: 1.60mm L x 0.80mm W; Height: 0.55mm; Mounting Type: Surface Mount; Luminous Flux @ Current - Test: -; ComponentLink1URL: http://optoelectronics.liteon.com/upload/download/DS22-2000-228/S_110_LTST-C191KGKT.pdf; ComponentLink1Description: http://optoelectronics.liteon.com/upload/download/DS22-2000-228/S_110_LTST-C191KGKT.pdf; Supplier Part Number 1: 160-1446-1-ND; ClassName: *
R13 = RES SMD 56.2K OHM 1% 1/10W 0603: Power (Watts): 0.1W; Temperature Coefficient: ±100ppm/°C; Resistance: 56.2K; Supplier 1: Digi-Key; Supplier Part Number 1: P56.2KHCT-ND
R14 = RES 1K OHM 1% 1/10W 0603: as R6 on sheet STM32-ROMI_Rev_A_3_OLED_Sensor; Supplier 1: Digi-Key; RoHS: RoHS Compliant; Category: Resistors; Stock 1: 411308; Pricing 1: 1=0.1, 10=0.02, 100=0.0081, 1000=0.00364, 2500=0.00316 (USD); Packaging: Cut Tape (CT); Part Status: Active; Composition: Thick Film; Features: Automotive AEC-Q200; Operating Temperature: -55°C ~ 155°C; Size / Dimension: 0.061" L x 0.031" W (1.55mm x 0.80mm); Height - Seated (Max): 0.022" (0.55mm); Failure Rate: -; ComponentLink1URL: https://www.seielect.com/Catalog/SEI-RMCF_RMCP.pdf; ComponentLink1Description: https://www.seielect.com/Catalog/SEI-RMCF_RMCP.pdf; Supplier Part Number 1: RMCF0603FT1K00CT-ND; Supplier Device Package: 0603; Resistance (Ohms): 1.0k
R15 = RES 10K OHM 1/10W 1% 0603 SMD: as R8 on sheet STM32-ROMI_Rev_A_3_OLED_Sensor; Category: Resistors; Supplier 1: Digi-Key; RoHS: RoHS Compliant; Stock 1: 5046430; Pricing 1: 1=0.1, 50=0.015, 100=0.0114, 250=0.00844, 500=0.00624, 1000=0.00416, 2500=0.00351 (USD); Packaging: Cut Tape (CT); Tolerance: ±1%; Composition: Thick Film; Features: -; Supplier Device Package: 0603; Size / Dimension: 0.063" L x 0.031" W (1.60mm x 0.80mm); Height: 0.022" (0.55mm); Number of Terminations: 2; ComponentLink1URL: http://industrial.panasonic.com/www-cgi/jvcr13pz.cgi?E+PZ+3+AOA0002+ERJ3EKF1002V+7+WW; ComponentLink1Description: http://industrial.panasonic.com/www-cgi/jvcr13pz.cgi?E+PZ+3+AOA0002+ERJ3EKF1002V+7+WW; Supplier Part Number 1: P10.0KHCT-ND
R16 = RES 100 OHM 1% 1/16W 0402: 100 0402; Manufacturer: Yageo; Manufacturer Part Number: RC0402FR-07100RL; Tolerance: ±1%; Power (Watts): 0.063W, 1/16W; Temperature Coefficient: ±100ppm/°C; Supplier 1: Digi-Key; RoHS: RoHS Compliant; Category: Resistors; Stock 1: 14557677; Pricing 1: 1=0.1, 10=0.014, 100=0.0056, 1000=0.00253, 2500=0.0022, 5000=0.00181 (USD); Packaging: Cut Tape (CT); Part Status: Active; Composition: Thick Film; Features: Moisture Resistant; Operating Temperature: -55°C ~ 155°C; Package / Case: 0402 (1005 Metric); Size / Dimension: 0.039" L x 0.020" W (1.00mm x 0.50mm); Height - Seated (Max): 0.016" (0.40mm); Failure Rate: -; ComponentLink1URL: http://www.yageo.com/documents/recent/PYu-RC_Group_51_RoHS_L_8.pdf; ComponentLink1Description: http://www.yageo.com/documents/recent/PYu-RC_Group_51_RoHS_L_8.pdf; Supplier Part Number 1: 311-100LRCT-ND
R70 = RES 100K OHM 1% 1/16W 0402: Manufacturer: Yageo; Manufacturer Part Number: RC0402FR-07100KL; Power (Watts): 0.1W, 1/10W; Temperature Coefficient: ±100ppm/°C; Tolerance: ±1%; RoHS: RoHS Compliant; Category: Resistors; Stock 1: 3706939; Pricing 1: 1=0.1, 50=0.0196, 100=0.0149, 250=0.01104, 500=0.00816, 1000=0.00544, 5000=0.00383 (USD); Packaging: Cut Tape (CT); Composition: Thick Film; Features: Automotive AEC-Q200; Operating Temperature: -55°C ~ 155°C; Package / Case: 0402 (1005 Metric); Size / Dimension: 0.039" L x 0.020" W (1.00mm x 0.50mm); Height: 0.016" (0.40mm); Number of Terminations: 2; ComponentLink1URL: http://industrial.panasonic.com/www-cgi/jvcr13pz.cgi?E+PZ+3+AOA0002+ERJ2RKF1003X+7+WW; ComponentLink1Description: http://industrial.panasonic.com/www-cgi/jvcr13pz.cgi?E+PZ+3+AOA0002+ERJ2RKF1003X+7+WW; Supplier 1: Digi-Key; Supplier 2: Digi-Key; Supplier Part Number 1: 311-100KLRCT-ND; Supplier Part Number 2: RMCF0402FT100KCT-ND
R71 = RES 0.0 OHM JUMPER 1/10W 0402: 0.0 0402; Manufacturer: Panasonic Electronic Components; Manufacturer Part Number: ERJ-2GE0R00X; Tolerance: Jumper; Power (Watts): 0.1W, 1/10W; Supplier 1: Digi-Key; RoHS: RoHS Compliant; Category: Resistors; Stock 1: 8429476; Pricing 1: 1=0.1, 50=0.0138, 100=0.0105, 250=0.0078, 500=0.00576, 1000=0.00384, 5000=0.0027 (USD); Packaging: Cut Tape (CT); Composition: Thick Film; Features: Automotive AEC-Q200; Temperature Coefficient: -; Operating Temperature: -55°C ~ 155°C; Package / Case: 0402 (1005 Metric); Size / Dimension: 0.039" L x 0.020" W (1.00mm x 0.50mm); Height: 0.016" (0.40mm); Number of Terminations: 2; ComponentLink1URL: http://industrial.panasonic.com/www-cgi/jvcr13pz.cgi?E+PZ+3+AOA0001+ERJ2GE0R00X+7+WW; ComponentLink1Description: http://industrial.panasonic.com/www-cgi/jvcr13pz.cgi?E+PZ+3+AOA0001+ERJ2GE0R00X+7+WW; Supplier Part Number 1: P0.0JCT-ND; Creator: osman
TP3-TP8 = TestPoint: Test Point
U7 U15 U17 = LM66100DCKT: OR Controller P-Channel 1.5A CC
U14 = TPS563209DDCR: IC REG BUCK ADJ 3A TSOT23-6; Voltage - Input (Min): 4.5V; Voltage - Input (Max): 17V; Voltage - Output (Min/Fixed): 0.765V; Voltage - Output (Max): 7V; Frequency - Switching: 650KHZ; Topology: Buck; Supplier Device Package: TSOT-23-6; Manufacturer Part Number: TPS563209DDCR; Supplier 1: Digi-Key; Supplier Part Number 1: 296-40813-1-ND
U16 = LD1117S33: 3.3 volt fixed regulator, 800mA; Supplier 1: Digi-Key; Supplier Part Number 1: 497-1242-1-ND

## Sheet STM32-ROMI_Rev_A_5_IMU_IO.SchDoc: IMU I/O
size A4; Author: Kyle R; Organization: Altium Limited; Address1: L3, 12a Rodborough Rd; Address2: Frenchs Forest; Address3: NSW; Address4: Australia 2086; DocumentNumber: 9152020; Revision: A; SheetNumber: 5; SheetTotal: 7
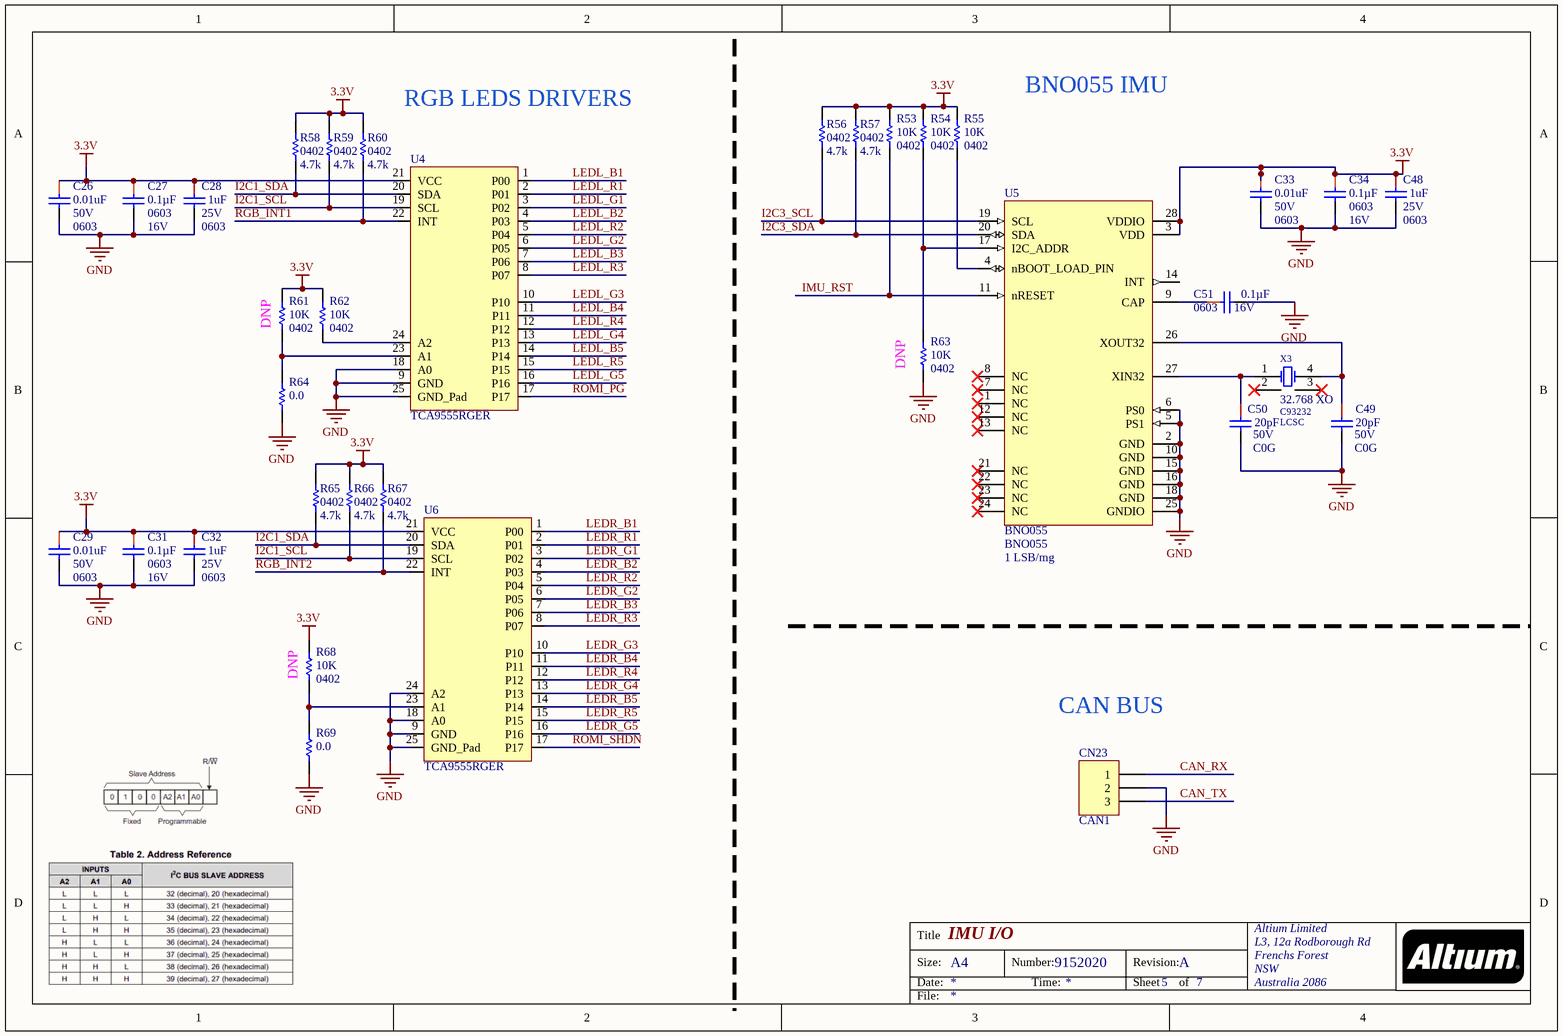
[diagram p5: STM32-ROMI_Rev_A_5_IMU_IO.SchDoc]

### Parts
C26  0.01uF  Voltage - Rated: 50V  Package / Case: 0603  [CAPC0603(1608)_L]
C27  Capacitance: 0.1µF  Package / Case: 0603  Voltage - Rated: 16V  [CAPC0603(1608)_L]  (hidden comment: 0.1uF)
C28  1uF  Voltage - Rated: 25V  Package / Case: 0603  [CAPC0603(1608)_N]
C29  0.01uF  Voltage - Rated: 50V  Package / Case: 0603  [CAPC0603(1608)_L]
C31  Capacitance: 0.1µF  Package / Case: 0603  Voltage - Rated: 16V  [CAPC0603(1608)_L]  (hidden comment: 0.1uF)
C32  1uF  Voltage - Rated: 25V  Package / Case: 0603  [CAPC0603(1608)_N]
C33  0.01uF  Voltage - Rated: 50V  Package / Case: 0603  [CAPC0603(1608)_L]
C34  Capacitance: 0.1µF  Package / Case: 0603  Voltage - Rated: 16V  [CAPC0603(1608)_L]  (hidden comment: 0.1uF)
C48  1uF  Voltage - Rated: 25V  Package / Case: 0603  [CAPC0603(1608)_N]
C49  Voltage - Rated: 50V  Temperature Coefficient: C0G  Capacitance: 20pF  [CAPC0402(1005)_L]  (hidden comment: 20pF 0402)
C50  Voltage - Rated: 50V  Temperature Coefficient: C0G  Capacitance: 20pF  [CAPC0402(1005)_L]  (hidden comment: 20pF 0402)
C51  Capacitance: 0.1µF  Package / Case: 0603  Voltage - Rated: 16V  [CAPC0603(1608)_L]  (hidden comment: 0.1uF)
CN23  CAN1  [HDR1X3]
R53  10K  Supplier Device Package: 0402  [RESC0402(1005)_N]
R54  10K  Supplier Device Package: 0402  [RESC0402(1005)_N]
R55  10K  Supplier Device Package: 0402  [RESC0402(1005)_N]
R56  Package / Case: 0402  [RESC0402(1005)_N]  (hidden comment: 4.7K)
R57  Package / Case: 0402  [RESC0402(1005)_N]  (hidden comment: 4.7K)
R58  Package / Case: 0402  [RESC0402(1005)_N]  (hidden comment: 4.7K)
R59  Package / Case: 0402  [RESC0402(1005)_N]  (hidden comment: 4.7K)
R60  Package / Case: 0402  [RESC0402(1005)_N]  (hidden comment: 4.7K)
R61  10K  Supplier Device Package: 0402  [RESC0402(1005)_N]  (no BOM)
R62  10K  Supplier Device Package: 0402  [RESC0402(1005)_N]
R63  10K  Supplier Device Package: 0402  [RESC0402(1005)_N]  (no BOM)
R64  Resistance (Ohms): 0.0  [RESC0402(1005)_L]  (hidden comment: 0)
R65  Package / Case: 0402  [RESC0402(1005)_N]  (hidden comment: 4.7K)
R66  Package / Case: 0402  [RESC0402(1005)_N]  (hidden comment: 4.7K)
R67  Package / Case: 0402  [RESC0402(1005)_N]  (hidden comment: 4.7K)
R68  10K  Supplier Device Package: 0402  [RESC0402(1005)_N]  (no BOM)
R69  Resistance (Ohms): 0.0  [RESC0402(1005)_L]  (hidden comment: 0)
U4  TCA9555RGER  [QFN50P400X400X100_HS-25N]
U5  BNO055  Sensitivity: 1 LSB/mg  [LGA-28-3.8x5.2mm]
U6  TCA9555RGER  [QFN50P400X400X100_HS-25N]
X3  32.768 XO  Supplier Part Number 2: C93232  Supplier 2: LCSC  [OSCABS]

### Nets
3.3V: C26.1 C27.1 C28.1 C29.1 C31.1 C32.1 C33.1 C34.1 C48.1 R53.2 R54.2 R55.2 R56.2 R57.2 R58.2 R59.2 R60.2 R61.2 R62.2 R65.2 R66.2 R67.2 R68.2 U4.21(VCC) U5.3(VDD) U5.28(VDDIO) U6.21(VCC)
GND: C26.2 C27.2 C28.2 C29.2 C31.2 C32.2 C33.2 C34.2 C48.2 C49.2 C50.2 C51.2 CN23.2 R63.1 R64.1 R69.1 U4.9(GND) U4.18(A0) U4.25(GND_Pad) U5.2(GND) U5.5(PS1) U5.6(PS0) U5.10(GND) U5.15(GND) U5.16(GND) U5.18(GND) U5.25(GNDIO) U6.9(GND) U6.18(A0) U6.24(A2) U6.25(GND_Pad)
CAN_RX: CN23.1
CAN_TX: CN23.3
I2C1_SCL: R59.1 R66.1 U4.19(SCL) U6.19(SCL)
I2C1_SDA: R58.1 R65.1 U4.20(SDA) U6.20(SDA)
I2C3_SCL: R56.1 U5.19(SCL)
I2C3_SDA: R57.1 U5.20(SDA)
IMU_RST: R53.1 U5.11(nRESET)
LEDL_B1: U4.1(P00)
LEDL_B2: U4.4(P03)
LEDL_B3: U4.7(P06)
LEDL_B4: U4.11(P11)
LEDL_B5: U4.14(P14)
LEDL_G1: U4.3(P02)
LEDL_G2: U4.6(P05)
LEDL_G3: U4.10(P10)
LEDL_G4: U4.13(P13)
LEDL_G5: U4.16(P16)
LEDL_R1: U4.2(P01)
LEDL_R2: U4.5(P04)
LEDL_R3: U4.8(P07)
LEDL_R4: U4.12(P12)
LEDL_R5: U4.15(P15)
LEDR_B1: U6.1(P00)
LEDR_B2: U6.4(P03)
LEDR_B3: U6.7(P06)
LEDR_B4: U6.11(P11)
LEDR_B5: U6.14(P14)
LEDR_G1: U6.3(P02)
LEDR_G2: U6.6(P05)
LEDR_G3: U6.10(P10)
LEDR_G4: U6.13(P13)
LEDR_G5: U6.16(P16)
LEDR_R1: U6.2(P01)
LEDR_R2: U6.5(P04)
LEDR_R3: U6.8(P07)
LEDR_R4: U6.12(P12)
LEDR_R5: U6.15(P15)
RGB_INT1: R60.1 U4.22(INT)
RGB_INT2: R67.1 U6.22(INT)
ROMI_PG: U4.17(P17)
ROMI_SHDN: U6.17(P17)
NetC49_1: C49.1 U5.26(XOUT32) X3.4(OSC2)
NetC50_1: C50.1 U5.27(XIN32) X3.1(OSC1)
NetC51_1: C51.1 U5.9(CAP)
NetR54_1: R54.1 R63.2 U5.17(I2C_ADDR)
NetR55_1: R55.1 U5.4(nBOOT_LOAD_PIN)
NetR61_1: R61.1 R64.2 U4.23(A1)
NetR62_1: R62.1 U4.24(A2)
NetR68_1: R68.1 R69.2 U6.23(A1)

Not connected (* = marked no-connect by the designer): U5 1(NC)* 7(NC)* 8(NC)* 12(NC)* 13(NC)* 14(INT) 21(NC)* 22(NC)* 23(NC)* 24(NC)*; X3 2(NC)* 3(NC)*

### Notes on the sheet
- RGB LEDS DRIVERS
- BNO055 IMU
- (near R61) DNP
- (near R63) DNP
- (near R68) DNP
- CAN BUS
- Title
- Size:
- Date:
- A4
- Number:
- Time:
- Revision:
- Sheet
- of
- File:

### Library data of the parts
C26 C29 C33 = CAP CER 0.01uF 50V 10% X7R 0603: 0.01uF 50V 0603; Manufacturer: Kemet; Manufacturer Part Number: C0603C103K5RACTU; Capacitance: 10000pF; Tolerance: ±10%; Temperature Coefficient: X7R; ClassName: MCU; Supplier 1: Digi-Key; RoHS: RoHS Compliant; Category: Capacitors; Stock 1: 1304139; Pricing 1: 1=0.1, 10=0.02, 25=0.014, 50=0.0106, 100=0.009, 250=0.00736, 1000=0.0048 (USD); Packaging: Cut Tape (CT); Mounting Type: Surface Mount, MLCC; Operating Temperature: -55°C ~ 125°C; Applications: General Purpose; Ratings: -; Size / Dimension: 0.063" L x 0.031" W (1.60mm x 0.80mm); Height - Seated (Max): -; Thickness (Max): 0.034" (0.87mm); Lead Spacing: -; Features: -; Lead Style: -; ComponentLink1URL: http://www.kemet.com/docfinder?Partnumber=C0603C103K5RACTU; ComponentLink1Description: http://www.kemet.com/docfinder?Partnumber=C0603C103K5RACTU; Supplier Part Number 1: 399-1091-1-ND
C27 C31 C34 C51 = CAP CER 0.1UF 16V 10% X7R 0603: as C21 on sheet STM32-ROMI_Rev_A_3_OLED_Sensor; Supplier 1: Digi-Key; RoHS: RoHS Compliant; Category: Capacitors; Stock 1: 2360000; Pricing 1: 4000=0.00414, 8000=0.00378, 12000=0.0036, 28000=0.00342, 100000=0.00248 (USD); Packaging: Tape & Reel (TR); Mounting Type: Surface Mount, MLCC; Operating Temperature: -55°C ~ 125°C; Applications: General Purpose; Ratings: -; Size / Dimension: 0.063" L x 0.031" W (1.60mm x 0.80mm); Height - Seated (Max): -; Thickness (Max): 0.034" (0.87mm); Lead Spacing: -; Features: -; Lead Style: -; ComponentLink1URL: http://www.kemet.com/datasheets&C0603C104K4RACTU; ComponentLink1Description: http://www.kemet.com/datasheets&C0603C104K4RACTU; Supplier Part Number 1: 399-1096-2-ND
C28 C32 C48 = CAP CER 1UF 25V 10% X7R 0603: as C55 on sheet STM32-ROMI_Rev_A_3_OLED_Sensor; Supplier 1: Digi-Key; RoHS: RoHS Compliant; Category: Capacitors; Stock 1: 360610; Pricing 1: 1=0.2, 10=0.135, 100=0.0686, 500=0.04696, 1000=0.04154 (USD); Packaging: Cut Tape (CT); Part Status: Active; Operating Temperature: -55°C ~ 125°C; Features: -; Ratings: AEC-Q200; Applications: Automotive; Failure Rate: -; Mounting Type: Surface Mount, MLCC; Size / Dimension: 0.063" L x 0.032" W (1.60mm x 0.80mm); Height - Seated (Max): -; Thickness (Max): 0.035" (0.90mm); Lead Spacing: -; Lead Style: -; ComponentLink1URL: https://product.tdk.com/info/en/catalog/datasheets/mlcc_automotive_general_en.pdf; ComponentLink1Description: https://product.tdk.com/info/en/catalog/datasheets/mlcc_automotive_general_en.pdf; Supplier Part Number 1: 445-6931-1-ND
C49 C50 = CAP CER 20PF 50V 2% NP0 0402: Manufacturer: Murata Electronics North America; Manufacturer Part Number: GRM1555C1H200GA01D; Tolerance: ±2%; ClassName: *; Supplier 1: Digi-Key; RoHS: RoHS Compliant; Category: Capacitors; Stock 1: 80973; Pricing 1: 1=0.11, 10=0.082, 50=0.0444, 100=0.0376, 250=0.03076, 500=0.02632, 1000=0.0201, 5000=0.01675 (USD); Packaging: Cut Tape (CT); Mounting Type: Surface Mount, MLCC; Operating Temperature: -55°C ~ 125°C; Applications: General Purpose; Ratings: -; Size / Dimension: 0.039" L x 0.020" W (1.00mm x 0.50mm); Height - Seated (Max): -; Thickness (Max): 0.022" (0.55mm); Lead Spacing: -; Features: -; Lead Style: -; ComponentLink1URL: http://www.murata.com/~/media/webrenewal/support/library/catalog/products/capacitor/mlcc/c02e.ashx; ComponentLink1Description: http://www.murata.com/~/media/webrenewal/support/library/catalog/products/capacitor/mlcc/c02e.ashx; Supplier Part Number 1: 490-6217-1-ND; Creator: osman
CN23 = Header 3: as CN19 on sheet STM32-ROMI_Rev_A_3_OLED_Sensor; Supplier 1: Digi-Key; RoHS: RoHS Compliant; Category: Connectors, Interconnects; Stock 1: 0; Pricing 1: 1=0.18, 10=0.16, 100=0.132, 500=0.10438, 1000=0.0896, 5000=0.08174, 10000=0.0786 (USD); Packaging: Bulk; Contact Type: Male Pin; Number of Rows: 1; Row Spacing: -; Contact Mating Length: 0.230" (5.84mm); Mounting Type: Through Hole; Termination: Solder; Fastening Type: -; Features: -; Contact Finish: Gold; Contact Finish Thickness: Flash; Color: Black; ComponentLink1URL: http://media.digikey.com/PDF/Data%20Sheets/Sullins%20PDFs/xRxCzzzSxxN-RC_ST_11635-B.pdf; ComponentLink1Description: http://media.digikey.com/PDF/Data%20Sheets/Sullins%20PDFs/xRxCzzzSxxN-RC_ST_11635-B.pdf; Supplier Part Number 1: S1011EC-03-ND
R53-R55 R61-R63 R68 = RES 10K OHM 1% 1/16W 0402: 10K 0402; Manufacturer: Samsung Electro-Mechanics; Manufacturer Part Number: RC1005F103CS; Tolerance: ±1%; Power (Watts): 0.063W, 1/16W; Temperature Coefficient: ±100ppm/°C; Supplier 1: Digi-Key; RoHS: RoHS Compliant; Category: Resistors; Stock 1: 25834562; Pricing 1: 1=0.1, 10=0.021, 100=0.0086, 1000=0.00385, 2500=0.00334, 5000=0.00276 (USD); Packaging: Cut Tape (CT); Part Status: Active; Composition: Thick Film; Features: Moisture Resistant; Operating Temperature: -55°C ~ 155°C; Package / Case: 0402 (1005 Metric); Size / Dimension: 0.039" L x 0.020" W (1.00mm x 0.50mm); Height - Seated (Max): 0.016" (0.40mm); Failure Rate: -; ComponentLink1URL: http://www.samsungsem.com/kr/support/product-search/chip-resistor/RC1005F103CS.jsp; ComponentLink1Description: http://www.samsungsem.com/kr/support/product-search/chip-resistor/RC1005F103CS.jsp; Supplier Part Number 1: 1276-3431-1-ND
R56-R60 R65-R67 = RES 4.7K OHM 1% 1/10W 0402: 4.7K 0402; Manufacturer: Yageo; Manufacturer Part Number: RC0402FR-074K7L; Tolerance: ±1%; Power Rating: 62.5mW; Resistance: 4.7KR; Temperature Coefficient: 100ppm/°C; Voltage Rating: 50V; ComponentLink1URL: http://industrial.panasonic.com/www-cgi/jvcr13pz.cgi?E+PZ+3+AOA0002+ERJ2RKF4701X+7+WW; ComponentLink1Description: http://industrial.panasonic.com/www-cgi/jvcr13pz.cgi?E+PZ+3+AOA0002+ERJ2RKF4701X+7+WW; Supplier 1: Digi-Key; Supplier Part Number 1: 311-4.7KLRCT-ND; Stock 1: 3132666; Pricing 1: 1=0.1, 10=0.014, 100=0.0056, 1000=0.0025, 2500=0.0022, 5000=0.0018 (USD); Case/Package: 0402; Number of Pins: 2; Case Code (Imperial): 0402; Case Code (Metric): 1005; Min Operating Temperature: -55°C; Max Operating Temperature: 155°C; Packaging: Tape and Reel; Composition: Thick Film; Termination: SMD/SMT; Military Standard: Not; Length: 1mm; Height: 0.32mm; Depth: 0.5mm; Width: 0.5mm; REACH SVHC: No SVHC; Lead Free: Lead Free; ComponentLink2URL: https://datasheet.ciiva.com/11819/0900766b80c66297-11819507.pdf; ComponentLink2Description: https://datasheet.ciiva.com/11819/0900766b80c66297-11819507.pdf; ComponentLink3URL: https://datasheet.ciiva.com/7850/1018594-7850022.pdf; ComponentLink3Description: https://datasheet.ciiva.com/7850/1018594-7850022.pdf; ComponentLink4URL: https://datasheet.ciiva.com/7850/1018594-7850023.pdf; ComponentLink4Description: https://datasheet.ciiva.com/7850/1018594-7850023.pdf; ComponentLink5URL: https://datasheet.ciiva.com/15215/getdatasheetpartid-328119-15215035.pdf; ComponentLink5Description: https://datasheet.ciiva.com/15215/getdatasheetpartid-328119-15215035.pdf; ComponentLink6URL: https://datasheet.ciiva.com/22661/1686128-22661342.pdf; ComponentLink6Description: https://datasheet.ciiva.com/22661/1686128-22661342.pdf; Category: Resistors; Resistance (Ohms): 4.7k
R64 R69 = RES 0.0 OHM JUMPER 1/10W 0402: as R71 on sheet STM32-ROMI_Rev_A_4_3V_5V; Supplier 1: Digi-Key; RoHS: RoHS Compliant; Category: Resistors; Stock 1: 8429476; Pricing 1: 1=0.1, 50=0.0138, 100=0.0105, 250=0.0078, 500=0.00576, 1000=0.00384, 5000=0.0027 (USD); Packaging: Cut Tape (CT); Composition: Thick Film; Features: Automotive AEC-Q200; Temperature Coefficient: -; Operating Temperature: -55°C ~ 155°C; Package / Case: 0402 (1005 Metric); Supplier Device Package: 0402; Size / Dimension: 0.039" L x 0.020" W (1.00mm x 0.50mm); Height: 0.016" (0.40mm); Number of Terminations: 2; ComponentLink1URL: http://industrial.panasonic.com/www-cgi/jvcr13pz.cgi?E+PZ+3+AOA0001+ERJ2GE0R00X+7+WW; ComponentLink1Description: http://industrial.panasonic.com/www-cgi/jvcr13pz.cgi?E+PZ+3+AOA0001+ERJ2GE0R00X+7+WW; Supplier Part Number 1: P0.0JCT-ND; Creator: osman
U4 U6 = CMP-001-0784-04: IC I/O EXPANDER I2C SMBUS 24VQFN; Manufacturer: Texas Instruments; Max Supply Voltage: 5.5V; Interface: I2C, SMBus; Number of I/Os: 16; Min Supply Voltage: 1.65V; Packaging: Cut Tape; Min Operating Temperature: -40°C; Case/Package: VQFN; REACH SVHC: No SVHC; Number of Pins: 24; Lead Free: Lead Free; Max Operating Temperature: 85°C; Manufacturer Part Number: TCA9555RGER
U5 = CMP-010-0024-02: 9-Axis Intertial Sensor; Manufacturer: Bosch Tools; Bandwidth: 1000 Hz; Product Status: New at Mouser; Operating Supply Current: 13.7 mA; Interface: HID-I2C, I2C, UART; Supply Voltage - Max: 3.6 V; Brand: Bosch Sensortec; Acceleration: 2 g, 4 g, 8 g, 16 g; Supply Voltage - Min: 2.4 V; Resolution: 16 bit; RoHS - Mouser: Y; Sensing Axis: 9-axis; RoHS: RoHS Compliant; Pin Count: 28; ComponentLink1URL: http://www.mouser.com/ds/2/621/BST_BNO055_DS000_12~1-531239.pdf; Stock 1: 5828; Package / Case: LGA-28; Maximum Operating Temperature: + 85 C; Packaging: Bulk; Component Name: BNO055; Minimum Order Quantity: 1; Minimum Operating Temperature: - 40 C; Reeling: False; ComponentLink1Description: http://www.mouser.com/ds/2/621/BST_BNO055_DS000_12~1-531239.pdf; Pricing 1: 1=17.58, 5=16.75, 10=16.43, 25=15.20, 50=15.01, 100=14.26, 250=13.30, 500=12.64, 1000=11.63 (AUD); Manufacturer Part Number: BNO055
X3 = DST310S 32.768KHz: SMD CRYSTAL RESONATORS 32.768KHZ ±20PPM SMD-3215_2P ROHS; Supplier 1: Digi-Key; Supplier Part Number 1: 535-10240-1-ND